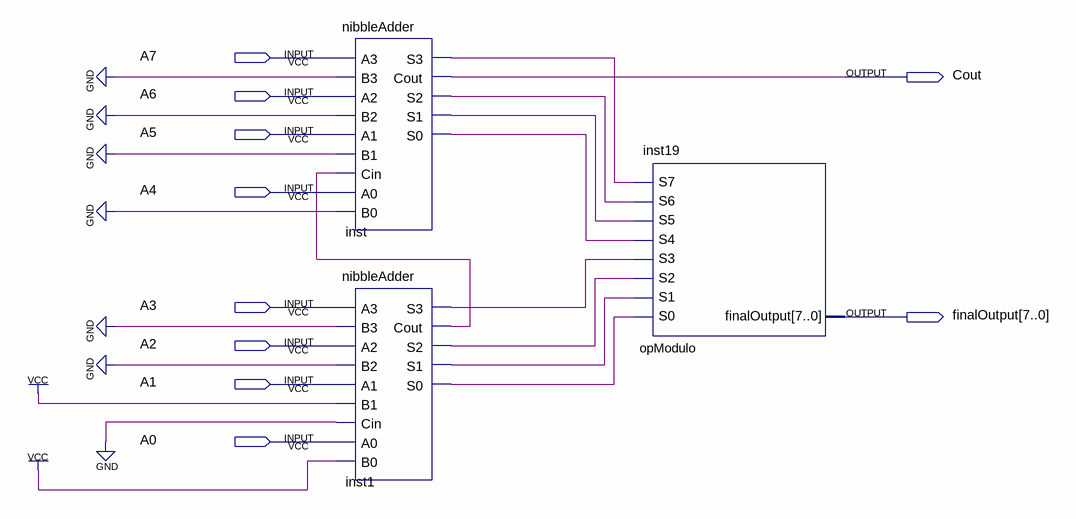
[diagram p0: schematic sheet]
// Quartus schematic byteAdder.bdf as structural Verilog: 3 symbols, 10 pins
module byteAdder (
  input  A7,
  input  A6,
  input  A5,
  input  A4,
  input  A3,
  input  A2,
  input  A1,
  input  A0,
  output Cout,
  output [7:0] finalOutput
);

  wire inst1_cout, inst1_s0, inst1_s1, inst1_s2, inst1_s3, inst_s0, inst_s1, inst_s2, inst_s3;

  nibbleAdder inst (
    .A3(A7), .B3(1'b0), .A2(A6), .B2(1'b0), .A1(A5), .B1(1'b0), .Cin(inst1_cout), .A0(A4), .B0(1'b0),
    .S3(inst_s3), .Cout(Cout), .S2(inst_s2), .S1(inst_s1), .S0(inst_s0));
  nibbleAdder inst1 (
    .A3(A3), .B3(1'b0), .A2(A2), .B2(1'b0), .A1(A1), .B1(1'b1), .Cin(1'b0), .A0(A0), .B0(1'b1),
    .S3(inst1_s3), .Cout(inst1_cout), .S2(inst1_s2), .S1(inst1_s1), .S0(inst1_s0));
  opModulo inst19 (
    .S0(inst1_s0), .S1(inst1_s1), .S2(inst1_s2), .S3(inst1_s3), .S4(inst_s0), .S5(inst_s1), .S6(inst_s2),
    .S7(inst_s3), .finalOutput(finalOutput));
endmodule
